# Altium schematic sheet Block_Design.SchDoc
size A4
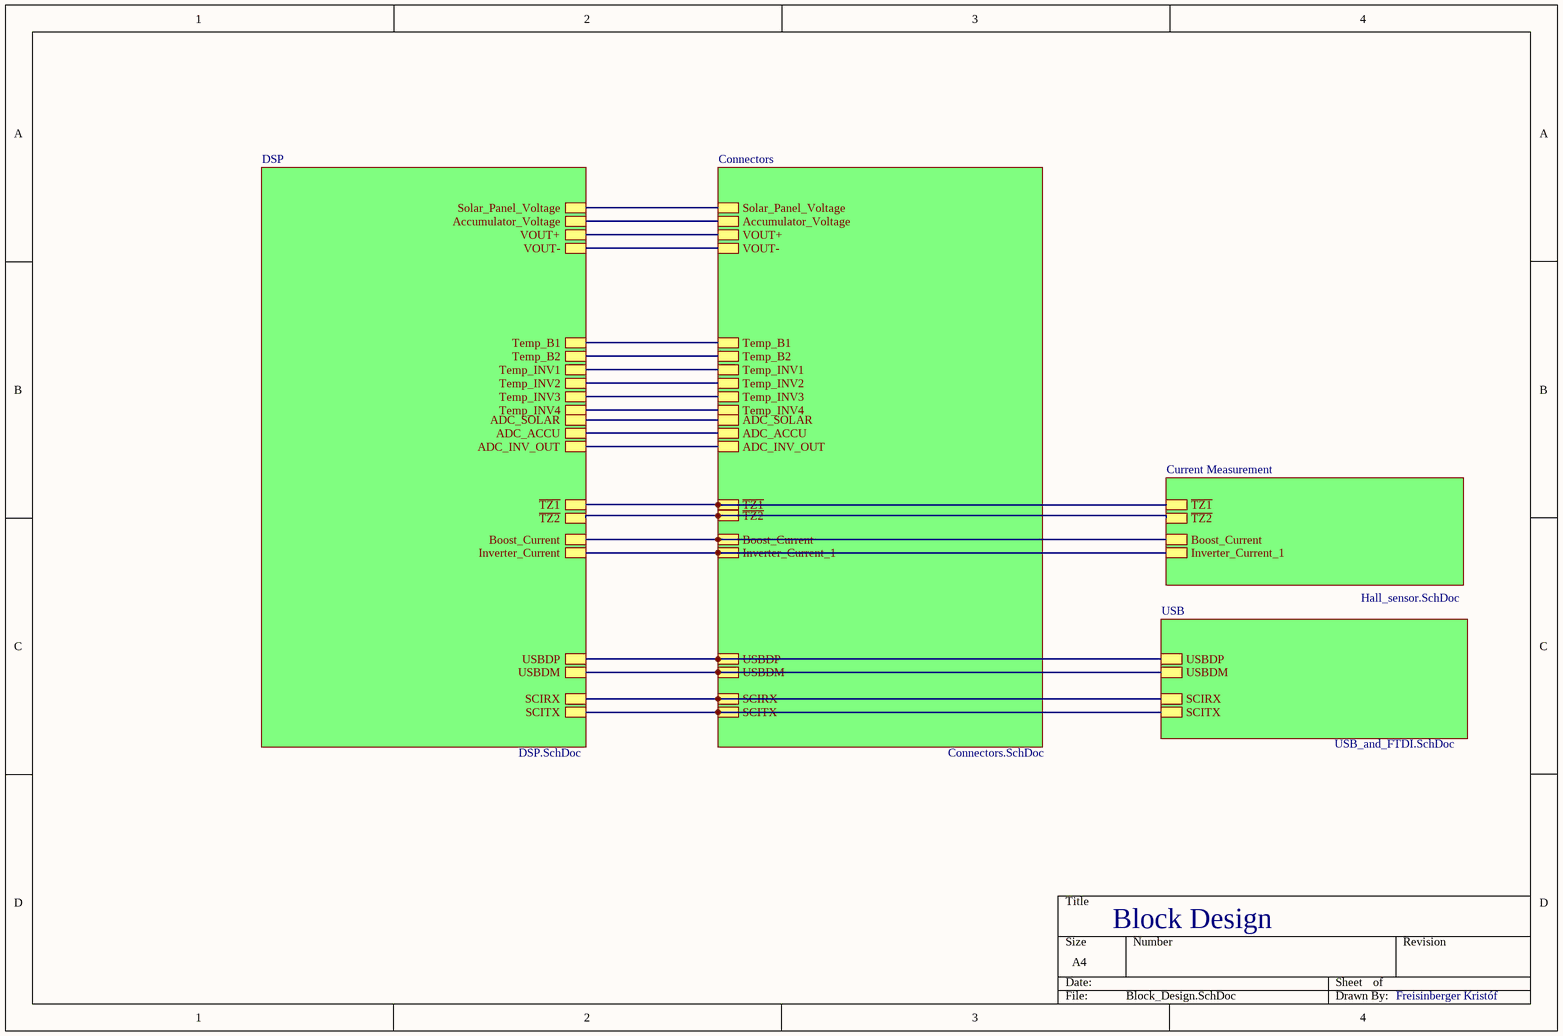
[diagram p0: Block_Design.SchDoc]

## Sub-sheets
Connectors = Connectors.SchDoc: Solar_Panel_Voltage, Accumulator_Voltage, VOUT+, VOUT-, Temp_B2, Temp_INV1, Temp_INV2, Temp_INV3, Temp_INV4, Temp_B1, ADC_SOLAR, ADC_ACCU, ADC_INV_OUT, USBDP, USBDM, SCIRX, SCITX, Boost_Current, Inverter_Current_1, ~{TZ1}, ~{TZ2}
Current Measurement = Hall_sensor.SchDoc: ~{TZ1}, ~{TZ2}, Inverter_Current_1, Boost_Current
DSP = DSP.SchDoc: Solar_Panel_Voltage, Accumulator_Voltage, VOUT+, VOUT-, Temp_B1, Temp_B2, Temp_INV1, Temp_INV2, Temp_INV3, Temp_INV4, ~{TZ1}, ~{TZ2}, ADC_SOLAR, ADC_ACCU, ADC_INV_OUT, SCITX, SCIRX, USBDM, USBDP, Boost_Current, Inverter_Current
USB = USB_and_FTDI.SchDoc: USBDP, USBDM, SCIRX, SCITX

## Nets
(unnamed): sheet DSP/Solar_Panel_Voltage, sheet Connectors/Solar_Panel_Voltage
(unnamed): sheet DSP/Accumulator_Voltage, sheet Connectors/Accumulator_Voltage
(unnamed): sheet DSP/VOUT+, sheet Connectors/VOUT+
(unnamed): sheet DSP/VOUT-, sheet Connectors/VOUT-
(unnamed): sheet DSP/Temp_B1, sheet Connectors/Temp_B1
(unnamed): sheet DSP/Temp_B2, sheet Connectors/Temp_B2
(unnamed): sheet DSP/Temp_INV1, sheet Connectors/Temp_INV1
(unnamed): sheet DSP/Temp_INV2, sheet Connectors/Temp_INV2
(unnamed): sheet DSP/Temp_INV3, sheet Connectors/Temp_INV3
(unnamed): sheet DSP/Temp_INV4, sheet Connectors/Temp_INV4
(unnamed): sheet DSP/~{TZ1}, sheet Connectors/~{TZ1}, sheet Current Measurement/~{TZ1}
(unnamed): sheet DSP/~{TZ2}, sheet Connectors/~{TZ2}, sheet Current Measurement/~{TZ2}
(unnamed): sheet DSP/ADC_SOLAR, sheet Connectors/ADC_SOLAR
(unnamed): sheet DSP/ADC_ACCU, sheet Connectors/ADC_ACCU
(unnamed): sheet DSP/ADC_INV_OUT, sheet Connectors/ADC_INV_OUT
(unnamed): sheet DSP/SCITX, sheet Connectors/SCITX, sheet USB/SCITX
(unnamed): sheet DSP/SCIRX, sheet Connectors/SCIRX, sheet USB/SCIRX
(unnamed): sheet DSP/USBDM, sheet Connectors/USBDM, sheet USB/USBDM
(unnamed): sheet DSP/USBDP, sheet Connectors/USBDP, sheet USB/USBDP
(unnamed): sheet DSP/Boost_Current, sheet Connectors/Boost_Current, sheet Current Measurement/Boost_Current
(unnamed): sheet DSP/Inverter_Current, sheet Connectors/Inverter_Current_1, sheet Current Measurement/Inverter_Current_1

## Notes on the sheet
- Block Design
- Freisinberger Kristóf